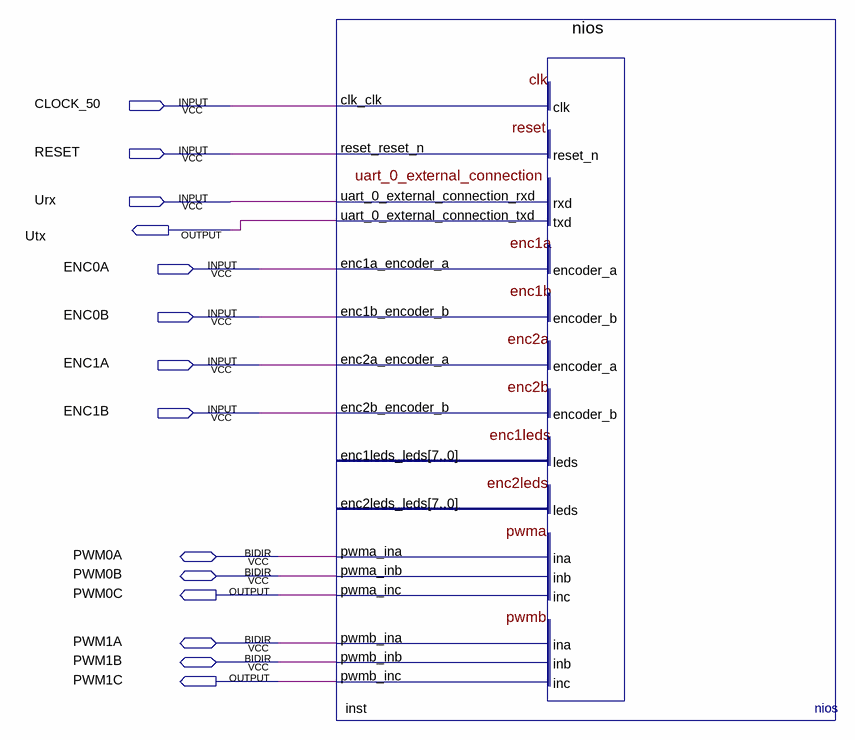
[diagram p0: schematic sheet]
// Quartus schematic setup_control.bdf as structural Verilog: 1 symbols, 14 pins
module setup_control (
  input  CLOCK_50,
  input  RESET,
  input  Urx,
  input  ENC0A,
  input  ENC0B,
  input  ENC1A,
  input  ENC1B,
  inout  PWM0A,
  inout  PWM0B,
  inout  PWM1A,
  inout  PWM1B,
  output Utx,
  output PWM0C,
  output PWM1C
);

  nios inst (
    .clk_clk(CLOCK_50), .reset_reset_n(RESET), .uart_0_external_connection_rxd(Urx), .enc1a_encoder_a(ENC0A),
    .enc1b_encoder_b(ENC0B), .enc2a_encoder_a(ENC1A), .enc2b_encoder_b(ENC1B),
    .uart_0_external_connection_txd(Utx), .pwma_inc(PWM0C), .pwmb_inc(PWM1C), .pwma_ina(PWM0A),
    .pwma_inb(PWM0B), .pwmb_ina(PWM1A), .pwmb_inb(PWM1B));  // open: enc1leds_leds, enc2leds_leds
endmodule
